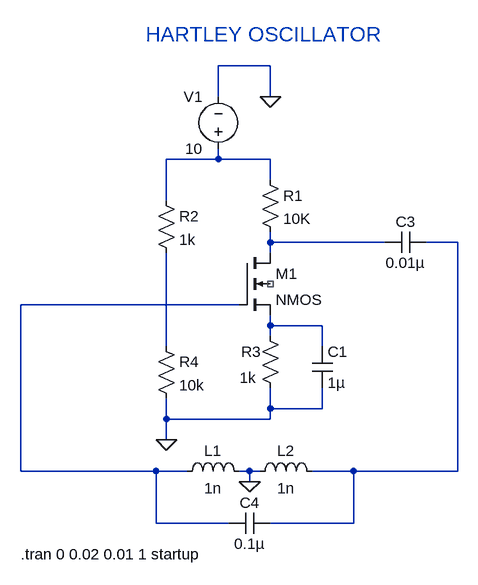
[diagram p0: schematic 15)hartely_oscillator.asc]
15)hartely_oscillator.asc, the LTspice schematic file:
Version 4
SHEET 1 880 680
WIRE 128 -256 48 -256
WIRE 48 -208 48 -256
WIRE 128 -208 128 -256
WIRE 48 -112 48 -128
WIRE 48 -112 -32 -112
WIRE 128 -112 48 -112
WIRE 128 -80 128 -112
WIRE -32 -48 -32 -112
WIRE 128 16 128 0
WIRE 304 16 128 16
WIRE 416 16 368 16
WIRE 128 32 128 16
WIRE 80 112 -256 112
WIRE 128 144 128 128
WIRE 208 144 128 144
WIRE 128 160 128 144
WIRE -32 176 -32 32
WIRE 208 176 208 144
WIRE 128 272 128 240
WIRE 208 272 208 240
WIRE 208 272 128 272
WIRE -32 288 -32 256
WIRE 128 288 128 272
WIRE 128 288 -32 288
WIRE -32 320 -32 288
WIRE -256 368 -256 112
WIRE -48 368 -256 368
WIRE 0 368 -48 368
WIRE 96 368 80 368
WIRE 112 368 96 368
WIRE 256 368 192 368
WIRE 416 368 416 16
WIRE 416 368 256 368
WIRE 96 384 96 368
WIRE -48 448 -48 368
WIRE 64 448 -48 448
WIRE 256 448 256 368
WIRE 256 448 128 448
FLAG -32 320 0
FLAG 128 -208 0
FLAG 96 384 0
SYMBOL nmos4 80 32 R0
SYMATTR InstName M1
SYMBOL res 112 -96 R0
SYMATTR InstName R1
SYMATTR Value 10K
SYMBOL res -48 -64 R0
SYMATTR InstName R2
SYMATTR Value 1k
SYMBOL res 112 144 R0
WINDOW 0 -29 40 Left 2
WINDOW 3 -31 80 Left 2
SYMATTR InstName R3
SYMATTR Value 1k
SYMBOL cap 192 176 R0
SYMATTR InstName C1
SYMATTR Value 1µ
SYMBOL res -48 160 R0
SYMATTR InstName R4
SYMATTR Value 10k
SYMBOL cap 368 0 R90
WINDOW 0 0 32 VBottom 2
WINDOW 3 32 32 VTop 2
SYMATTR InstName C3
SYMATTR Value 0.01µ
SYMBOL ind -16 384 R270
WINDOW 0 32 56 VTop 2
WINDOW 3 5 56 VBottom 2
SYMATTR InstName L1
SYMATTR Value 1n
SYMBOL ind 96 384 R270
WINDOW 0 32 56 VTop 2
WINDOW 3 5 56 VBottom 2
SYMATTR InstName L2
SYMATTR Value 1n
SYMBOL voltage 48 -112 R180
WINDOW 0 24 96 Left 2
WINDOW 3 24 16 Left 2
WINDOW 123 0 0 Left 0
WINDOW 39 0 0 Left 0
SYMATTR InstName V1
SYMATTR Value 10
SYMBOL cap 128 432 R90
WINDOW 0 0 32 VBottom 2
WINDOW 3 32 32 VTop 2
SYMATTR InstName C4
SYMATTR Value 0.1µ
TEXT -64 -304 Left 3 ;HARTLEY OSCILLATOR
TEXT -256 496 Left 2 !.tran 0 0.02 0.01 1 startup

The netlist it stands for:
* 15)hartely_oscillator.asc
M1 N002 N004 N005 NC_01 NMOS
R1 N001 N002 10K
R2 N001 N006 1k
R3 N005 0 1k
C1 N005 0 1µ
R4 N006 0 10k
C3 N003 N002 0.01µ
L1 N004 0 1n
L2 0 N003 1n
V1 N001 0 10
C4 N003 N004 0.1µ
.model NMOS NMOS
.model PMOS PMOS
.lib standard.mos
* HARTLEY OSCILLATOR
.tran 0 0.02 0.01 1 startup
.backanno
.end